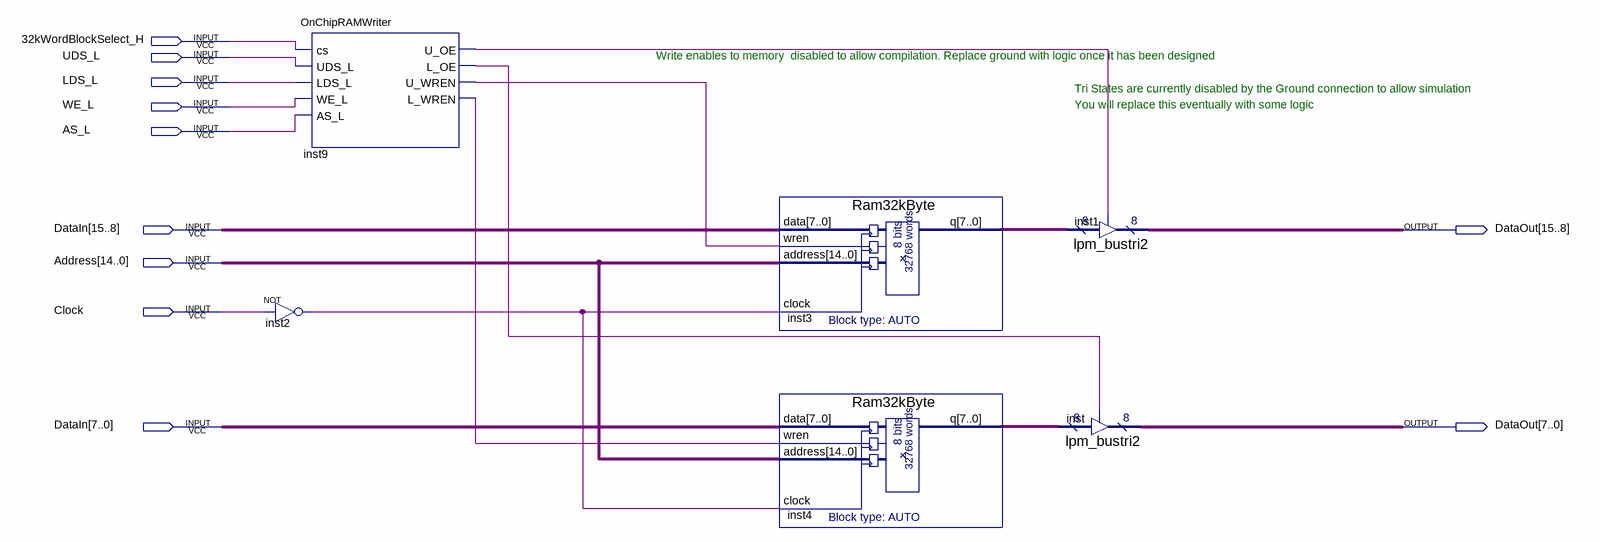
[diagram p0: schematic sheet]
// Quartus schematic SramBlock_32KWord.bdf as structural Verilog: 6 symbols, 11 pins
module SramBlock_32KWord (
  input  \32kWordBlockSelect_H ,
  input  UDS_L,
  input  LDS_L,
  input  WE_L,
  input  AS_L,
  input  [15:0] DataIn,
  input  [14:0] Address,
  input  Clock,
  output [15:0] DataOut
);

  wire inst2_out, inst9_l_oe, inst9_l_wren, inst9_u_oe, inst9_u_wren;
  wire [7:0] inst3_q, inst4_q;

  not inst2 (inst2_out, Clock);
  OnChipRAMWriter inst9 (
    .cs(\32kWordBlockSelect_H ), .UDS_L(UDS_L), .LDS_L(LDS_L), .WE_L(WE_L), .AS_L(AS_L), .U_OE(inst9_u_oe),
    .L_OE(inst9_l_oe), .U_WREN(inst9_u_wren), .L_WREN(inst9_l_wren));
  Ram32kByte inst3 (.data(DataIn[15:8]), .wren(inst9_u_wren), .address(Address), .clock(inst2_out), .q(inst3_q));
  Ram32kByte inst4 (.data(DataIn[7:0]), .wren(inst9_l_wren), .address(Address), .clock(inst2_out), .q(inst4_q));
  lpm_bustri2 inst1 (.enabledt(inst9_u_oe), .data(inst3_q), .tridata(DataOut[15:8]));
  lpm_bustri2 inst (.enabledt(inst9_l_oe), .data(inst4_q), .tridata(DataOut[7:0]));

  // Notes on the sheet:
  //   Write enables to memory  disabled to allow compilation. Replace ground with logic once it has been designed
  //   Tri States are currently disabled by the Ground connection to allow simulation
  //   You will replace this eventually with some logic
endmodule
